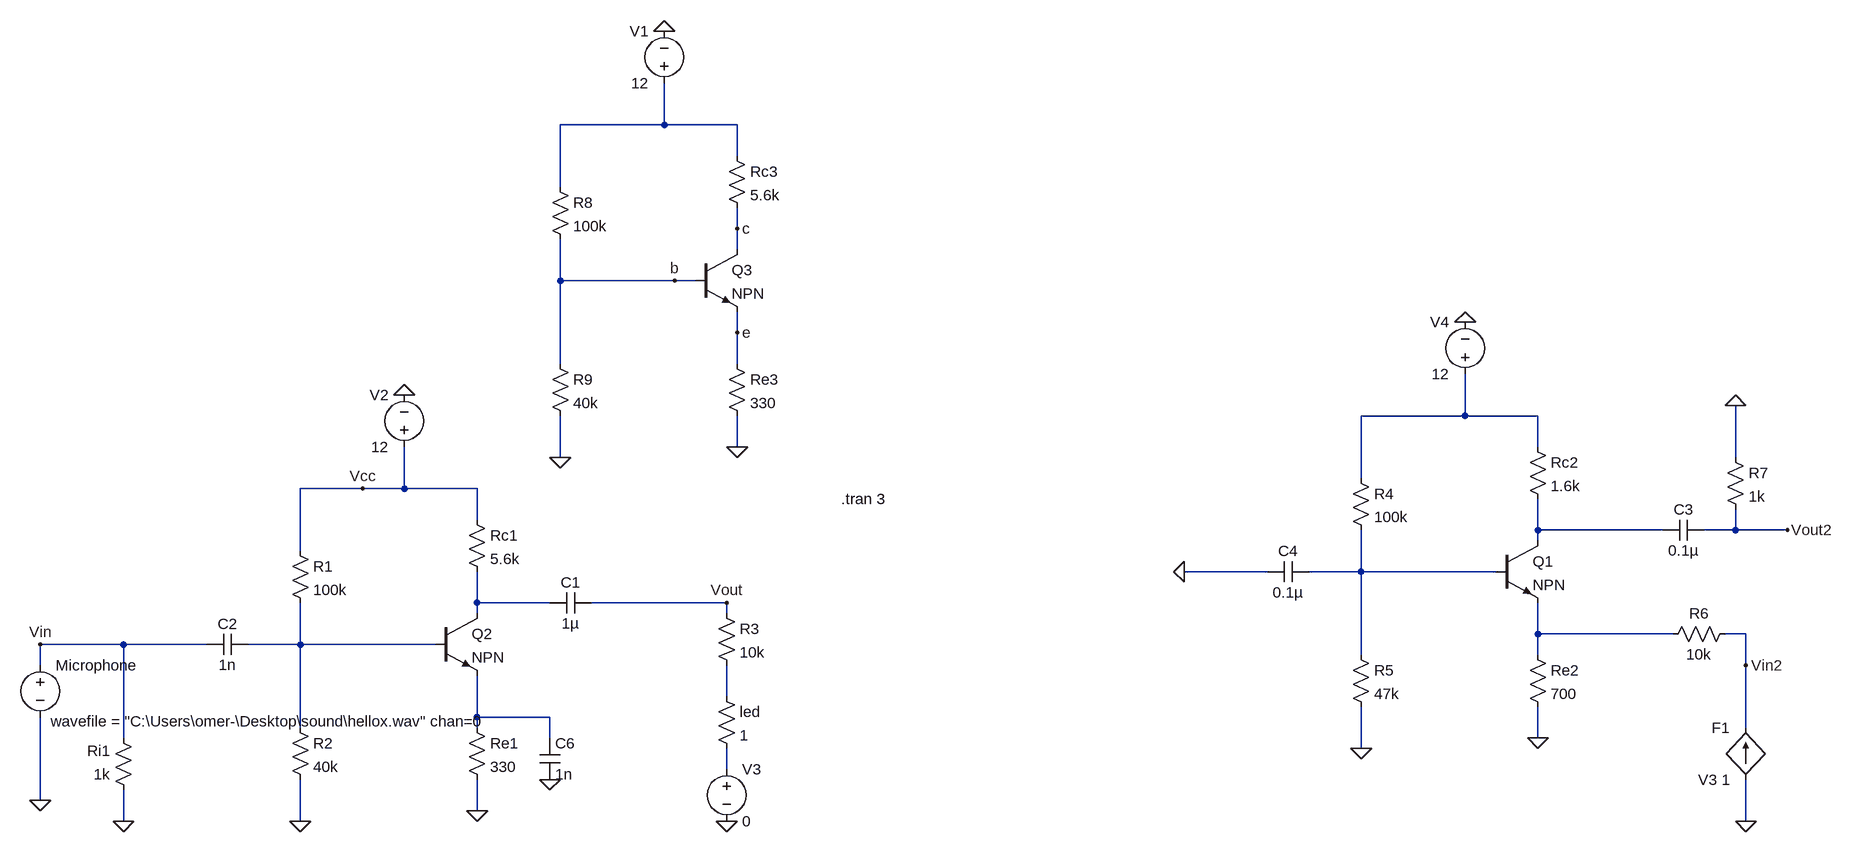
[diagram p0: schematic project_sound_deneme_fail.asc]
project_sound_deneme_fail.asc, the LTspice schematic file:
Version 4
SHEET 1 1796 680
WIRE -16 -544 -16 -608
WIRE -16 -544 -176 -544
WIRE 96 -544 -16 -544
WIRE 96 -496 96 -544
WIRE -176 -448 -176 -544
WIRE 96 -384 96 -416
WIRE 96 -352 96 -384
WIRE -176 -304 -176 -368
WIRE 0 -304 -176 -304
WIRE 32 -304 0 -304
WIRE 96 -224 96 -256
WIRE -176 -176 -176 -304
WIRE 96 -176 96 -224
WIRE 1216 -96 1216 -160
WIRE 1216 -96 1056 -96
WIRE 1328 -96 1216 -96
WIRE 96 -48 96 -96
WIRE 1328 -48 1328 -96
WIRE -176 -32 -176 -96
WIRE 1632 -32 1632 -112
WIRE 1056 0 1056 -96
WIRE -480 16 -576 16
WIRE -416 16 -416 -48
WIRE -416 16 -480 16
WIRE -304 16 -416 16
WIRE -304 64 -304 16
WIRE 1328 80 1328 32
WIRE 1520 80 1328 80
WIRE 1632 80 1632 48
WIRE 1632 80 1584 80
WIRE 1712 80 1632 80
WIRE 1328 96 1328 80
WIRE -576 112 -576 16
WIRE 912 144 784 144
WIRE 1056 144 1056 80
WIRE 1056 144 976 144
WIRE 1264 144 1056 144
WIRE -304 192 -304 144
WIRE -192 192 -304 192
WIRE 80 192 -128 192
WIRE -304 208 -304 192
WIRE 80 208 80 192
WIRE 1328 240 1328 192
WIRE 1536 240 1328 240
WIRE 1648 240 1616 240
WIRE -848 256 -976 256
WIRE -720 256 -848 256
WIRE -576 256 -576 192
WIRE -576 256 -656 256
WIRE -368 256 -576 256
WIRE 1056 272 1056 144
WIRE 1328 272 1328 240
WIRE -976 288 -976 256
WIRE 1648 288 1648 240
WIRE 80 336 80 288
WIRE -304 368 -304 304
WIRE -192 368 -304 368
WIRE -576 384 -576 256
WIRE -304 384 -304 368
WIRE 1648 384 1648 288
WIRE -848 400 -848 256
WIRE -192 400 -192 368
WIRE 1328 400 1328 352
WIRE 1056 416 1056 352
WIRE 80 448 80 416
WIRE -976 496 -976 368
WIRE -304 512 -304 464
WIRE -848 528 -848 480
WIRE -576 528 -576 464
WIRE 1648 528 1648 464
FLAG -976 496 0
FLAG -576 528 0
FLAG -976 256 Vin
FLAG -480 16 Vcc
FLAG 80 192 Vout
FLAG -416 -128 0
FLAG -848 528 0
FLAG 1056 416 0
FLAG 1216 -240 0
FLAG 784 144 0
FLAG 1648 528 0
FLAG 1328 400 0
FLAG 1632 -112 0
FLAG 1712 80 Vout2
FLAG 80 528 0
FLAG 1648 288 Vin2
FLAG -192 464 0
FLAG -304 512 0
FLAG -176 -32 0
FLAG -16 -688 0
FLAG 96 -48 0
FLAG 96 -384 c
FLAG 96 -224 e
FLAG 0 -304 b
SYMBOL res -592 96 R0
SYMATTR InstName R1
SYMATTR Value 100k
SYMBOL res -320 48 R0
SYMATTR InstName Rc1
SYMATTR Value 5.6k
SYMBOL res -592 368 R0
SYMATTR InstName R2
SYMATTR Value 40k
SYMBOL res -320 368 R0
SYMATTR InstName Re1
SYMATTR Value 330
SYMBOL res -832 496 R180
WINDOW 0 36 76 Left 2
WINDOW 3 36 40 Left 2
SYMATTR InstName Ri1
SYMATTR Value 1k
SYMBOL cap -656 240 R90
WINDOW 0 0 32 VBottom 2
WINDOW 3 32 32 VTop 2
SYMATTR InstName C2
SYMATTR Value 1n
SYMBOL voltage -976 272 R0
WINDOW 123 24 124 Left 2
WINDOW 39 0 0 Left 0
WINDOW 3 16 102 Left 2
SYMATTR Value wavefile = "C:\Users\omer-\Desktop\sound\hellox.wav" chan=0
SYMATTR InstName Microphone
SYMBOL voltage -416 -32 R180
WINDOW 0 24 96 Left 2
WINDOW 3 24 16 Left 2
WINDOW 123 0 0 Left 0
WINDOW 39 0 0 Left 0
SYMATTR InstName V2
SYMATTR Value 12
SYMBOL res 64 192 R0
SYMATTR InstName R3
SYMATTR Value 10k
SYMBOL res 64 320 R0
SYMATTR InstName led
SYMATTR Value 1
SYMBOL res 1040 -16 R0
SYMATTR InstName R4
SYMATTR Value 100k
SYMBOL res 1312 -64 R0
SYMATTR InstName Rc2
SYMATTR Value 1.6k
SYMBOL res 1040 256 R0
SYMATTR InstName R5
SYMATTR Value 47k
SYMBOL res 1312 256 R0
SYMATTR InstName Re2
SYMATTR Value 700
SYMBOL cap 1584 64 R90
WINDOW 0 0 32 VBottom 2
WINDOW 3 32 32 VTop 2
SYMATTR InstName C3
SYMATTR Value 0.1µ
SYMBOL cap 976 128 R90
WINDOW 0 0 32 VBottom 2
WINDOW 3 32 32 VTop 2
SYMATTR InstName C4
SYMATTR Value 0.1µ
SYMBOL voltage 1216 -144 R180
WINDOW 0 24 96 Left 2
WINDOW 3 24 16 Left 2
WINDOW 123 0 0 Left 0
WINDOW 39 0 0 Left 0
SYMATTR InstName V4
SYMATTR Value 12
SYMBOL res 1632 224 R90
WINDOW 0 0 56 VBottom 2
WINDOW 3 32 56 VTop 2
SYMATTR InstName R6
SYMATTR Value 10k
SYMBOL res 1616 -48 R0
SYMATTR InstName R7
SYMATTR Value 1k
SYMBOL f 1648 464 R180
WINDOW 0 24 80 Left 2
WINDOW 3 24 0 Left 2
SYMATTR InstName F1
SYMATTR Value V3 1
SYMBOL voltage 80 432 R0
WINDOW 123 0 0 Left 0
WINDOW 39 0 0 Left 0
SYMATTR InstName V3
SYMATTR Value 0
SYMBOL npn 1264 96 R0
SYMATTR InstName Q1
SYMBOL npn -368 208 R0
SYMATTR InstName Q2
SYMBOL cap -208 400 R0
SYMATTR InstName C6
SYMATTR Value 1n
SYMBOL res -192 -464 R0
SYMATTR InstName R8
SYMATTR Value 100k
SYMBOL res 80 -512 R0
SYMATTR InstName Rc3
SYMATTR Value 5.6k
SYMBOL res -192 -192 R0
SYMATTR InstName R9
SYMATTR Value 40k
SYMBOL res 80 -192 R0
SYMATTR InstName Re3
SYMATTR Value 330
SYMBOL voltage -16 -592 R180
WINDOW 0 24 96 Left 2
WINDOW 3 24 16 Left 2
WINDOW 123 0 0 Left 0
WINDOW 39 0 0 Left 0
SYMATTR InstName V1
SYMATTR Value 12
SYMBOL npn 32 -352 R0
SYMATTR InstName Q3
SYMBOL cap -128 176 R90
WINDOW 0 0 32 VBottom 2
WINDOW 3 32 32 VTop 2
SYMATTR InstName C1
SYMATTR Value 1µ
TEXT 256 32 Left 2 !.tran 3

The netlist it stands for:
* project_sound_deneme_fail.asc
R1 Vcc N007 100k
Rc1 Vcc N005 5.6k
R2 N007 0 40k
Re1 N009 0 330
Ri1 0 Vin 1k
C2 N007 Vin 1n
V§Microphone Vin 0 wavefile = "C:\Users\omer-\Desktop\sound\hellox.wav" chan=0
V2 Vcc 0 12
R3 Vout N008 10k
R§led N008 N010 1
R4 N002 N004 100k
Rc2 N002 N003 1.6k
R5 N004 0 47k
Re2 N006 0 700
C3 Vout2 N003 0.1µ
C4 N004 0 0.1µ
V4 N002 0 12
R6 Vin2 N006 10k
R7 0 Vout2 1k
F1 0 Vin2 V3 1
V3 N010 0 0
Q1 N003 N004 N006 0 NPN
Q2 N005 N007 N009 0 NPN
C6 N009 0 1n
R8 N001 b 100k
Rc3 N001 c 5.6k
R9 b 0 40k
Re3 e 0 330
V1 N001 0 12
Q3 c b e 0 NPN
C1 Vout N005 1µ
.model NPN NPN
.model PNP PNP
.lib standard.bjt
.tran 3
.backanno
.end